# Altium project Cortes.PrjPcb (part 1 of 3)
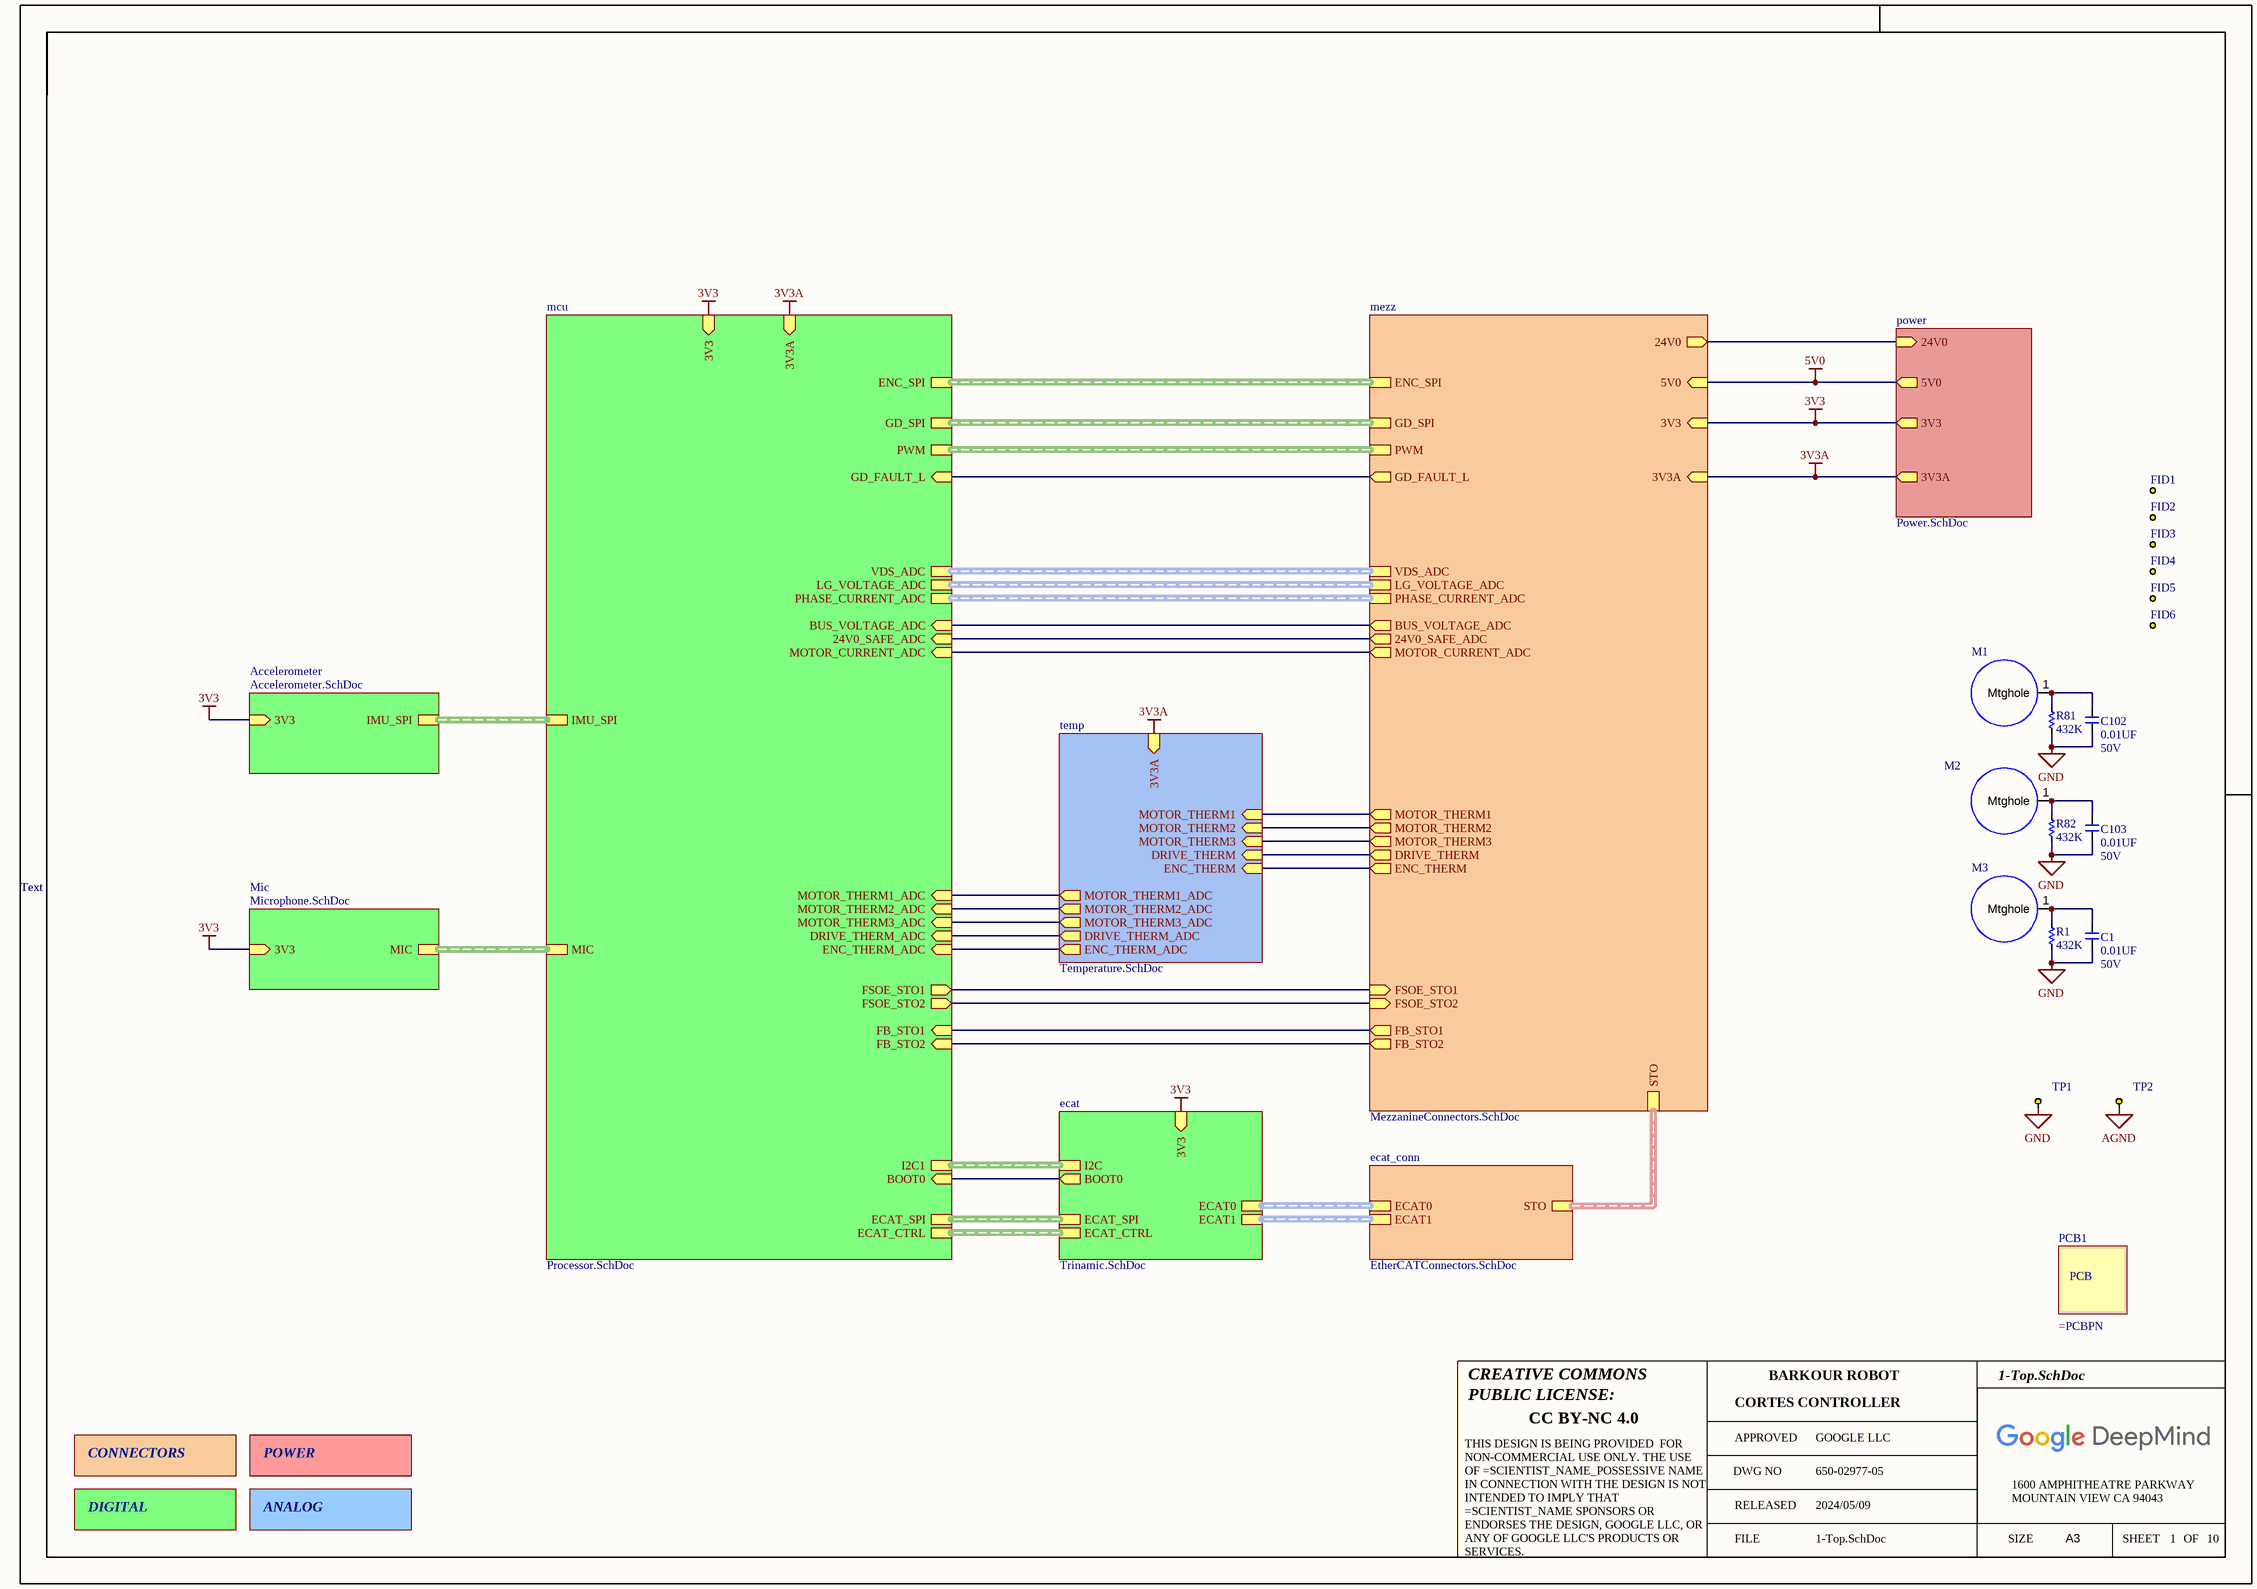
[diagram p0: 1-Top.SchDoc]
GPN_PCB: 651-02977-05; GPN_PCBA: 650-02977-05; PROJECT_NAME: CORTES CONTROLLER; Scientist_Name: CORINNA CORTES; Scientist_Name_Possessive: CORINNA CORTES'S
10 sheets, 268 parts. Net scope: hierarchical (ports join the sheet entries above them; power ports are global).
Board file: Cortes.PcbDoc
Sheets:
  1-Top.SchDoc
    mcu = Processor.SchDoc
      proc_support = ProcessorSupport.SchDoc
    Accelerometer = Accelerometer.SchDoc
    ecat = Trinamic.SchDoc
    power = Power.SchDoc
    temp = Temperature.SchDoc
    Mic = Microphone.SchDoc
    mezz = MezzanineConnectors.SchDoc
    ecat_conn = EtherCATConnectors.SchDoc

## Sheet 1-Top.SchDoc
size 420 x 297 mm; SheetNumber: 1; SheetTotal: 10; PageSetup: Record=PageOptions|CenterHorizontal=True|CenterVertical=True|PrintScale=0.96|XCorrection=1.00|YCorrection=1.00|PrintKind=1|BorderSize=5000000|LeftOffset=0|BottomOffset=0|Orientation=2|PaperLength=4318|PaperWidth=2794|Scale=100|PaperSource=7|PrintQuality=600|MediaType=1|DitherType=10|PaperKind=11" x 17"|PrintScaleMode=1

### Parts
C1  value 0.01UF  Voltage: 50V  [C0402]  (hidden comment: __Template_Cap)
C102  value 0.01UF  Voltage: 50V  [C0402]  (hidden comment: __Template_Cap)
C103  value 0.01UF  Voltage: 50V  [C0402]  (hidden comment: __Template_Cap)
FID1  FIDUCIAL  [FIDUCIAL_1MM]  (value not drawn)  (no BOM)
FID2  FIDUCIAL  [FIDUCIAL_1MM]  (value not drawn)  (no BOM)
FID3  FIDUCIAL  [FIDUCIAL_1MM]  (value not drawn)  (no BOM)
FID4  FIDUCIAL  [FIDUCIAL_1MM]  (value not drawn)  (no BOM)
FID5  FIDUCIAL  [FIDUCIAL_1MM]  (value not drawn)  (no BOM)
FID6  FIDUCIAL  [FIDUCIAL_1MM]  (value not drawn)  (no BOM)
M1  3.7mm hole 5mm pad  [3.7hole5pad]  (value not drawn)
M2  3.7mm hole 5mm pad  [3.7hole5pad]  (value not drawn)
M3  3.7mm hole 5mm pad  [3.7hole5pad]  (value not drawn)
PCB1  PCB  (value not drawn)  (mechanical)
R1  value 432K  [R0805]
R81  value 432K  [R0805]
R82  value 432K  [R0805]
TP1  TEST_KEYSTONE5001  [TP_KEYSTONE_5001]  (value not drawn)
TP2  TEST_KEYSTONE5001  [TP_KEYSTONE_5001]  (value not drawn)

### Sub-sheets
Accelerometer = Accelerometer.SchDoc: IMU_SPI (harness SPI_AGM), 3V3 (in)
ecat = Trinamic.SchDoc: ECAT_SPI (harness SPI), ECAT_CTRL (harness Ethercat_Control), 3V3 (in), ECAT0 (harness ECAT), ECAT1 (harness ECAT), I2C (harness I2C), BOOT0 (out)
ecat_conn = EtherCATConnectors.SchDoc: ECAT0 (harness ECAT), STO (harness STO), ECAT1 (harness ECAT)
mcu = Processor.SchDoc: ENC_SPI (harness SPI), IMU_SPI (harness SPI_AGM), MIC (harness PDM), 3V3 (in), 3V3A (in), PWM (harness PWM), GD_SPI (harness SPI), GD_FAULT_L (in), VDS_ADC (harness Phases), LG_VOLTAGE_ADC (harness Phases), PHASE_CURRENT_ADC (harness Phases), MOTOR_CURRENT_ADC (in), 24V0_SAFE_ADC (in), BUS_VOLTAGE_ADC (in), MOTOR_THERM1_ADC (in), MOTOR_THERM2_ADC (in), MOTOR_THERM3_ADC (in), DRIVE_THERM_ADC (in), ECAT_SPI (harness SPI), ECAT_CTRL (harness Ethercat_Control), ENC_THERM_ADC (in), FSOE_STO2 (out), FB_STO1 (in), FB_STO2 (in), FSOE_STO1 (out), I2C1 (harness I2C), BOOT0 (in)
mezz = MezzanineConnectors.SchDoc: 24V0 (out), 3V3A (in), MOTOR_THERM1 (out), MOTOR_THERM2 (out), MOTOR_THERM3 (out), VDS_ADC (harness Phases), LG_VOLTAGE_ADC (harness Phases), MOTOR_CURRENT_ADC (out), 24V0_SAFE_ADC (out), PHASE_CURRENT_ADC (harness Phases), BUS_VOLTAGE_ADC (out), DRIVE_THERM (out), PWM (harness PWM), GD_SPI (harness SPI), FSOE_STO2 (in), FB_STO1 (out), FB_STO2 (out), FSOE_STO1 (in), GD_FAULT_L (out), 3V3 (in), STO (harness STO), ENC_SPI (harness SPI), ENC_THERM (out), 5V0 (in)
Mic = Microphone.SchDoc: MIC (harness PDM), 3V3 (in)
power = Power.SchDoc: 24V0 (in), 5V0 (out), 3V3 (out), 3V3A (out)
temp = Temperature.SchDoc: 3V3A (in), MOTOR_THERM1 (in), MOTOR_THERM2 (in), MOTOR_THERM3 (in), DRIVE_THERM (in), MOTOR_THERM1_ADC (out), MOTOR_THERM2_ADC (out), MOTOR_THERM3_ADC (out), DRIVE_THERM_ADC (out), ENC_THERM (in), ENC_THERM_ADC (out)

### Nets
3V3: sheet mcu/3V3, sheet Accelerometer/3V3, sheet ecat/3V3, sheet power/3V3, sheet Mic/3V3, sheet mezz/3V3
3V3A: sheet mcu/3V3A, sheet power/3V3A, sheet temp/3V3A, sheet mezz/3V3A
5V0: sheet power/5V0, sheet mezz/5V0
AGND: TP2.1
GND: C1.2 C102.2 C103.2 R1.1 R81.1 R82.1 TP1.1
24V0: sheet power/24V0, sheet mezz/24V0
24V0_SAFE_ADC: sheet mcu/24V0_SAFE_ADC, sheet mezz/24V0_SAFE_ADC
BOOT0: sheet mcu/BOOT0, sheet ecat/BOOT0
BUS_VOLTAGE_ADC: sheet mcu/BUS_VOLTAGE_ADC, sheet mezz/BUS_VOLTAGE_ADC
DRIVE_THERM: sheet temp/DRIVE_THERM, sheet mezz/DRIVE_THERM
DRIVE_THERM_ADC: sheet mcu/DRIVE_THERM_ADC, sheet temp/DRIVE_THERM_ADC
ENC_THERM_ADC: sheet mcu/ENC_THERM_ADC, sheet temp/ENC_THERM_ADC
FB_STO1: sheet mcu/FB_STO1, sheet mezz/FB_STO1
FB_STO2: sheet mcu/FB_STO2, sheet mezz/FB_STO2
FSOE_STO1: sheet mcu/FSOE_STO1, sheet mezz/FSOE_STO1
FSOE_STO2: sheet mcu/FSOE_STO2, sheet mezz/FSOE_STO2
GD_FAULT_L: sheet mcu/GD_FAULT_L, sheet mezz/GD_FAULT_L
MOTOR_CURRENT_ADC: sheet mcu/MOTOR_CURRENT_ADC, sheet mezz/MOTOR_CURRENT_ADC
MOTOR_THERM1: sheet temp/MOTOR_THERM1, sheet mezz/MOTOR_THERM1
MOTOR_THERM1_ADC: sheet mcu/MOTOR_THERM1_ADC, sheet temp/MOTOR_THERM1_ADC
MOTOR_THERM2: sheet temp/MOTOR_THERM2, sheet mezz/MOTOR_THERM2
MOTOR_THERM2_ADC: sheet mcu/MOTOR_THERM2_ADC, sheet temp/MOTOR_THERM2_ADC
MOTOR_THERM3: sheet temp/MOTOR_THERM3, sheet mezz/MOTOR_THERM3
MOTOR_THERM3_ADC: sheet mcu/MOTOR_THERM3_ADC, sheet temp/MOTOR_THERM3_ADC
NetC1_1: C1.1 M3.1(Mtghole) R1.2
NetC18_1: sheet temp/ENC_THERM, sheet mezz/ENC_THERM
NetC102_1: C102.1 M1.1(Mtghole) R81.2
NetC103_1: C103.1 M2.1(Mtghole) R82.2

### Buses and harness runs
harness sheet Accelerometer/IMU_SPI = sheet mcu/IMU_SPI
harness sheet ecat/ECAT0 = sheet ecat_conn/ECAT0
harness sheet ecat/ECAT1 = sheet ecat_conn/ECAT1
harness sheet ecat/ECAT_CTRL = sheet mcu/ECAT_CTRL
harness sheet ecat/ECAT_SPI = sheet mcu/ECAT_SPI
harness sheet ecat/I2C = sheet mcu/I2C1
harness sheet ecat_conn/STO = sheet mezz/STO
harness sheet mcu/ENC_SPI = sheet mezz/ENC_SPI
harness sheet mcu/GD_SPI = sheet mezz/GD_SPI
harness sheet mcu/LG_VOLTAGE_ADC = sheet mezz/LG_VOLTAGE_ADC
harness sheet mcu/MIC = sheet Mic/MIC
harness sheet mcu/PHASE_CURRENT_ADC = sheet mezz/PHASE_CURRENT_ADC
harness sheet mcu/PWM = sheet mezz/PWM
harness sheet mcu/VDS_ADC = sheet mezz/VDS_ADC

### Notes on the sheet
- Text
- CONNECTORS
- POWER
- DIGITAL
- ANALOG
- CREATIVE COMMONS
- PUBLIC LICENSE:
- BARKOUR ROBOT
- CC BY-NC 4.0
- APPROVED
- DWG NO
- GOOGLE LLC
- FILE
- RELEASED
- 2024/05/09
- SIZE
- 1600 AMPHITHEATRE PARKWAY
- MOUNTAIN VIEW CA 94043
- A3
- SHEET
- OF
- THIS DESIGN IS BEING PROVIDED  FOR NON-COMMERCIAL USE ONLY. THE USE OF =SCIENTIST_NAME_POSSESSIVE NAME IN CONNECTION WITH THE DESIGN IS NOT INTENDED TO IMPLY THAT =SCIENTIST_NAME SPONSORS OR ENDORSES THE DESIGN, GOOGLE LLC, OR ANY OF GOOGLE LLC'S PRODUCTS OR SERVICES.

### Library data of the parts
C1 C102 C103 = 625: CAP, CER, X7R, 0.01uF, 50V, 20%, 0402, 0.56mm T; ID: 625; MFG: KEMET; MFG P/N: C0402C103M5RACTU; XPN: 150-00227-00; EES: 150-04592-00; Status: Released; Package: 0402; Dielectric: X7R; Tolerance: 20%; Height: 0.56mm T; ComponentLink1Description: Datasheet; COMMON: 150-00227-00; LOON: 150-00227-00; Gecko: 150-00227-00
FID1-FID6 = 93: FIDUCIAL 1MM COPPER CIRCLE 3MM MASK PULLBACK; ID: 93; MFG: _PCB Feature; Status: In Development
M1-M3 = MtgHole
PCB1 = 110: ID: 110; Level: 1; FindNumber: 010; Org: ORG - REP; Type: PCB; GPN: =PCBPN; Status: In Development; MFG P/N: =PCBPN; PROXY: =PCBPN; Type: 651-PCB; ItemNumber: =PCBPN; ProductLine: Proxy
R1 R81 R82 = 5492: Resistor, 432K Ohms, 0805, 0.125W, ±1%; ID: 5492; MFG: YAGEO; MFG P/N: RC0805FR-07432KL; Power: 1/8W; COMMON: 470-08723-00; XPN: XS-10019230; EES: 470-17987-00; Status: Released; Package: 0805; Tolerance: 1%; Height: 0.60mm; Supplier 1: Digi-Key; LOON: 470-08723-00; Gecko: 470-08723-00; Supplier Part Number 1: 311-432KCRCT-ND
TP1 TP2 = TEST_KEYSTONE5001: PC TEST POINT TH RING; Manufacturer: Keystone Electronics; Manufacturer Part Number: 5001; Part Number: 250-00184-00; Supplier 1: Digi-Key; Supplier Part Number 1: 5001K-ND; RoHS: RoHS Compliant; Category: Test and Measurement; Stock 1: 341830; Pricing 1: 1=0.33, 10=0.309, 50=0.2252, 100=0.2164, 250=0.19432, 500=0.18548, 1000=0.15456, 2500=0.14131, 5000=0.13248 (USD); Packaging: Bulk; Type: PC Test Point, Miniature; Terminal: 0.010" x 0.020" (0.25mm x 0.51mm) Phosphor Bronze Wire, Silver Plate; Mounting Type: 0.040" (1.02mm) Hole Diameter; Material: Base, Nylon 46, UL 94V-0; Color: Black; ComponentLink1URL: http://www.keyelco.com/product-pdf.cfm?p=1310; ComponentLink1Description: http://www.keyelco.com/product-pdf.cfm?p=1310

## Sheet Processor.SchDoc
size 420 x 297 mm; SheetNumber: 6; SheetTotal: 10; PageSetup: Record=PageOptions|CenterHorizontal=True|CenterVertical=True|PrintScale=0.96|XCorrection=1.00|YCorrection=1.00|PrintKind=1|BorderSize=5000000|LeftOffset=0|BottomOffset=0|Orientation=2|PaperLength=4318|PaperWidth=2794|Scale=100|PaperSource=7|PrintQuality=600|MediaType=1|DitherType=10|PaperKind=11" x 17"|PrintScaleMode=1
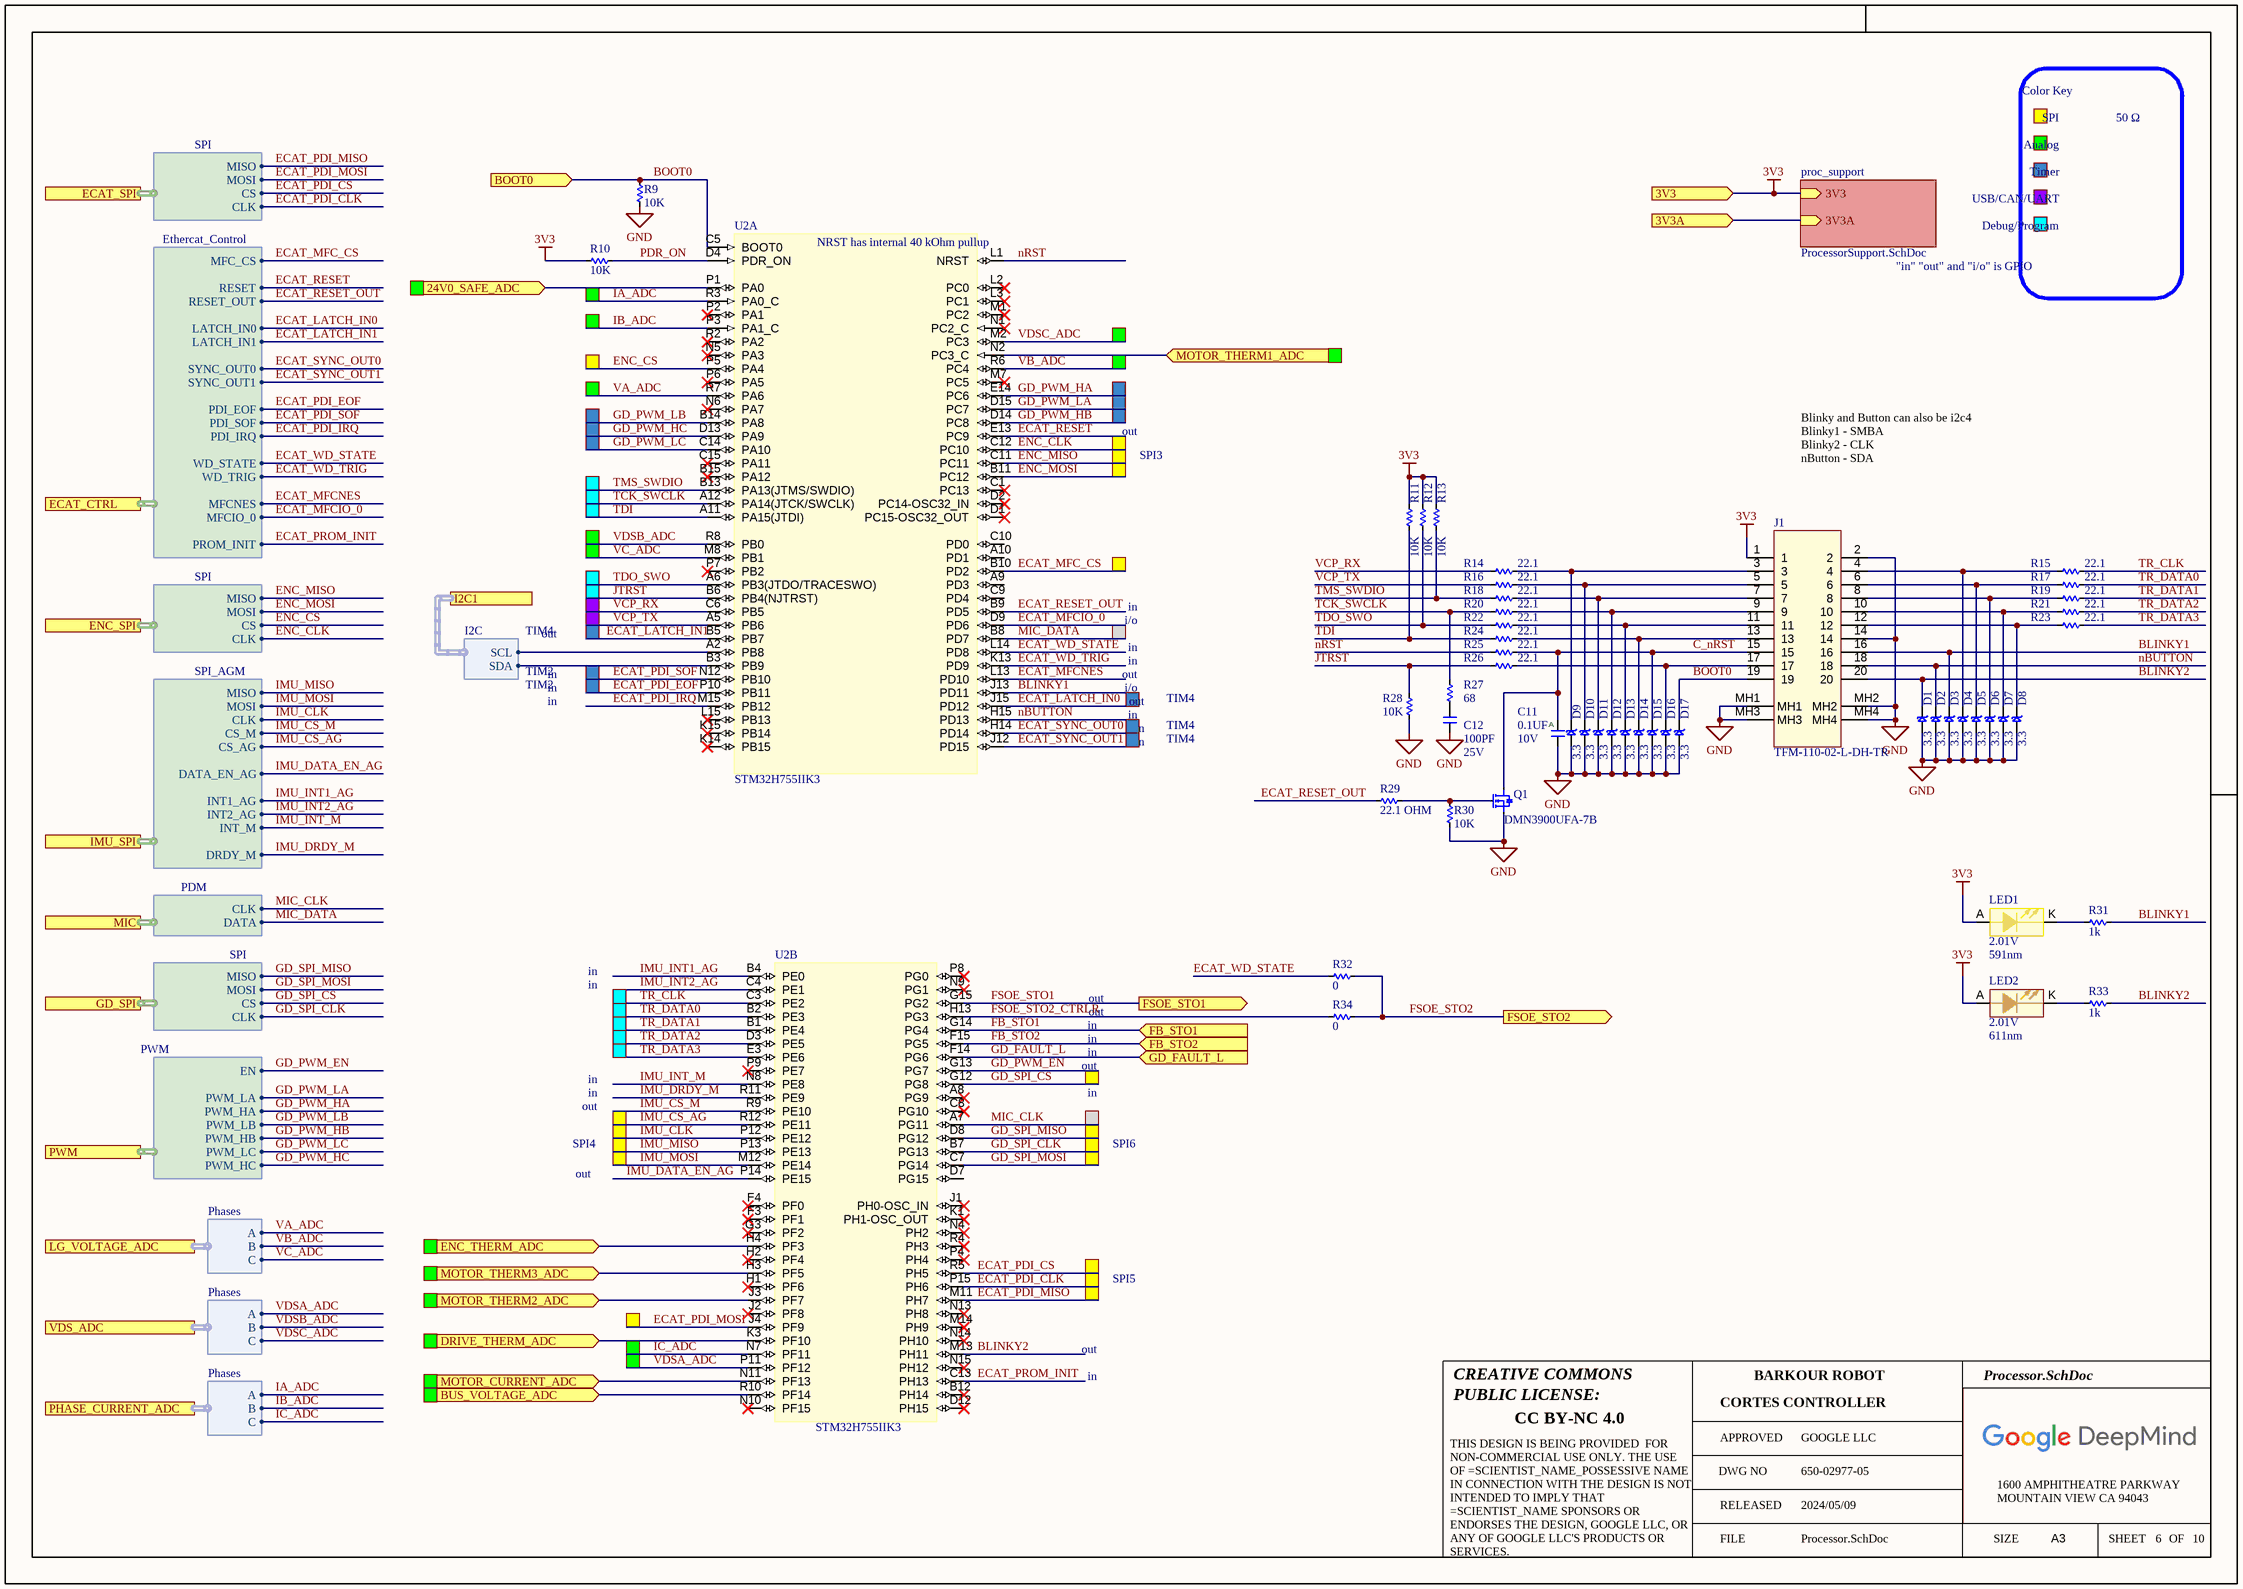
[diagram p1: Processor.SchDoc]

### Parts
C11  value 0.1UF  Voltage: 10V  [C0201Y]  (hidden comment: __Template_Cap_Auto)
C12  value 100PF  Voltage: 25V  [C0201Y]  (hidden comment: __Template_Cap)
D1  3.3  [SOD1060X40]
D2  3.3  [SOD1060X40]
D3  3.3  [SOD1060X40]
D4  3.3  [SOD1060X40]
D5  3.3  [SOD1060X40]
D6  3.3  [SOD1060X40]
D7  3.3  [SOD1060X40]
D8  3.3  [SOD1060X40]
D9  3.3  [SOD1060X40]
D10  3.3  [SOD1060X40]
D11  3.3  [SOD1060X40]
D12  3.3  [SOD1060X40]
D13  3.3  [SOD1060X40]
D14  3.3  [SOD1060X40]
D15  3.3  [SOD1060X40]
D16  3.3  [SOD1060X40]
D17  3.3  [SOD1060X40]
J1  MFG P/N: TFM-110-02-L-DH-TR  [SAMTEC_TFM-110-02-L-DH]
LED1  Voltage – Forward (VF) (MAX) @ IF: 2.01V  Color / Wavelength: 591nm  [LED_APG0603SYC-TT]  (hidden comment: __Template_LED_YELLOW_AK)
LED2  Voltage – Forward (VF) (MAX) @ IF: 2.01V  Color / Wavelength: 611nm  [LED_APG0603SYC-TT]  (hidden comment: __Template_LED_ORANGE_AK)
Q1  MFG P/N: DMN3900UFA-7B  [3XDFN]  (hidden comment: NFET_DMN3900UFA)
R9  value 10K  [R0201_H0.26MM]  (hidden comment: __Template_Resistor)
R10  value 10K  [R0201_H0.26MM]  (hidden comment: __Template_Resistor)
R11  value 10K  [R0201_H0.26MM]  (hidden comment: __Template_Resistor)
R12  value 10K  [R0201_H0.26MM]  (hidden comment: __Template_Resistor)
R13  value 10K  [R0201_H0.26MM]  (hidden comment: __Template_Resistor)
R14  value 22.1  [R0201_H0.26MM]  (hidden comment: __Template_Resistor)
R15  value 22.1  [R0201_H0.26MM]  (hidden comment: __Template_Resistor)
R16  value 22.1  [R0201_H0.26MM]  (hidden comment: __Template_Resistor)
R17  value 22.1  [R0201_H0.26MM]  (hidden comment: __Template_Resistor)
R18  value 22.1  [R0201_H0.26MM]  (hidden comment: __Template_Resistor)
R19  value 22.1  [R0201_H0.26MM]  (hidden comment: __Template_Resistor)
R20  value 22.1  [R0201_H0.26MM]  (hidden comment: __Template_Resistor)
R21  value 22.1  [R0201_H0.26MM]  (hidden comment: __Template_Resistor)
R22  value 22.1  [R0201_H0.26MM]  (hidden comment: __Template_Resistor)
R23  value 22.1  [R0201_H0.26MM]  (hidden comment: __Template_Resistor)
R24  value 22.1  [R0201_H0.26MM]  (hidden comment: __Template_Resistor)
R25  value 22.1  [R0201_H0.26MM]  (hidden comment: __Template_Resistor)
R26  value 22.1  [R0201_H0.26MM]  (hidden comment: __Template_Resistor)
R27  value 68  [R0201_H0.26MM]  (hidden comment: __Template_Resistor)
R28  value 10K  [R0201_H0.26MM]  (hidden comment: __Template_Resistor)
R29  value 22.1 OHM  [R0201_H0.26MM]  (hidden comment: __Template_Resistor)
R30  value 10K  [R0201_H0.26MM]  (hidden comment: __Template_Resistor)
R31  value 1k  [R0201_H0.26MM]  (hidden comment: __Template_Resistor)
R32  value 0  [R0603]  (hidden comment: __Template_Resistor)
R33  value 1k  [R0201_H0.26MM]  (hidden comment: __Template_Resistor)
R34  value 0  [R0603]  (hidden comment: __Template_Resistor)
U2  MFG P/N: STM32H755IIK3  [BGS201C65P15X15_1000X1000X60]  (hidden comment: MCU_STM32H755IIK3)  (parts A,B of 3)

### Sub-sheets
proc_support = ProcessorSupport.SchDoc: 3V3 (in), 3V3A (in)

### Ports
3V3 (in), 3V3A (in), 24V0_SAFE_ADC (in), BOOT0 (in), BUS_VOLTAGE_ADC (in), DRIVE_THERM_ADC (in), ECAT_CTRL (harness Ethercat_Control), ECAT_SPI (harness SPI), ENC_SPI (harness SPI), ENC_THERM_ADC (in), FB_STO1 (in), FB_STO2 (in), FSOE_STO1 (out), FSOE_STO2 (out), GD_FAULT_L (in), GD_SPI (harness SPI), I2C1 (harness I2C), IMU_SPI (harness SPI_AGM), LG_VOLTAGE_ADC (harness Phases), MIC (harness PDM), MOTOR_CURRENT_ADC (in), MOTOR_THERM1_ADC (in), MOTOR_THERM2_ADC (in), MOTOR_THERM3_ADC (in), PHASE_CURRENT_ADC (harness Phases), PWM (harness PWM), VDS_ADC (harness Phases)

### Harnesses
SPI: CLK, CS, MOSI, MISO
PDM: DATA, CLK
SPI: MISO, MOSI, CS, CLK
Ethercat_Control: MFC_CS, LATCH_IN0, LATCH_IN1, RESET_OUT, SYNC_OUT0, SYNC_OUT1, PDI_EOF, PDI_SOF, PDI_IRQ, RESET, WD_STATE, WD_TRIG, MFCNES, MFCIO_0, PROM_INIT
SPI_AGM: CLK, MOSI, CS_AG, DATA_EN_AG, CS_M, MISO, INT1_AG, INT2_AG, INT_M, DRDY_M
PWM: EN, PWM_LA, PWM_HA, PWM_LB, PWM_HB, PWM_LC, PWM_HC
Phases: A, B, C
I2C: SDA, SCL

### Nets
3V3: J1.1 LED1.A LED2.A R10.2 R11.2 R12.2 R13.2 ; port 3V3, sheet proc_support/3V3
3V3A: port 3V3A, sheet proc_support/3V3A
GND: C11.2 C12.2 D1.A D2.A D3.A D4.A D5.A D6.A D7.A D8.A D9.A D10.A D11.A D12.A D13.A D14.A D15.A D16.A D17.A J1.2 J1.14 J1.MH1 J1.MH2 J1.MH3 J1.MH4 Q1.2(S) R9.1 R28.1 R30.1
24V0_SAFE_ADC: U2.P1(PA0) ; port 24V0_SAFE_ADC
BLINKY1: D3.K J1.16 R31.1 U2.J13(PD11)
BLINKY2: D1.K J1.20 R33.1 U2.M13(PH11)
BOOT0: D17.K J1.19 R9.2 U2.C5(BOOT0) ; port BOOT0
BUS_VOLTAGE_ADC: U2.R10(PF14) ; port BUS_VOLTAGE_ADC
C_nRST: C11.1 D15.K J1.15 Q1.3(D) R25.2
DRIVE_THERM_ADC: U2.K3(PF10) ; port DRIVE_THERM_ADC
ECAT_LATCH_IN0: U2.J15(PD12) ; port ECAT_CTRL.LATCH_IN0
ECAT_LATCH_IN1: U2.B5(PB7) ; port ECAT_CTRL.LATCH_IN1
ECAT_MFC_CS: U2.B10(PD2) ; port ECAT_CTRL.MFC_CS
ECAT_MFCIO_0: U2.D9(PD6) ; port ECAT_CTRL.MFCIO_0
ECAT_MFCNES: U2.L13(PD10) ; port ECAT_CTRL.MFCNES
ECAT_PDI_CLK: U2.P15(PH6) ; port ECAT_SPI.CLK
ECAT_PDI_CS: U2.R5(PH5) ; port ECAT_SPI.CS
ECAT_PDI_EOF: U2.P10(PB11) ; port ECAT_CTRL.PDI_EOF
ECAT_PDI_IRQ: U2.M15(PB12) ; port ECAT_CTRL.PDI_IRQ
ECAT_PDI_MISO: U2.M11(PH7) ; port ECAT_SPI.MISO
ECAT_PDI_MOSI: U2.J4(PF9) ; port ECAT_SPI.MOSI
ECAT_PDI_SOF: U2.N12(PB10) ; port ECAT_CTRL.PDI_SOF
ECAT_PROM_INIT: U2.C13(PH13) ; port ECAT_CTRL.PROM_INIT
ECAT_RESET: U2.E13(PC9) ; port ECAT_CTRL.RESET
ECAT_RESET_OUT: R29.1 U2.B9(PD5) ; port ECAT_CTRL.RESET_OUT
ECAT_SYNC_OUT0: U2.H14(PD14) ; port ECAT_CTRL.SYNC_OUT0
ECAT_SYNC_OUT1: U2.J12(PD15) ; port ECAT_CTRL.SYNC_OUT1
ECAT_WD_STATE: R32.2 U2.L14(PD8) ; port ECAT_CTRL.WD_STATE
ECAT_WD_TRIG: U2.K13(PD9) ; port ECAT_CTRL.WD_TRIG
ENC_CLK: U2.C12(PC10) ; port ENC_SPI.CLK
ENC_CS: U2.P5(PA4) ; port ENC_SPI.CS
ENC_MISO: U2.C11(PC11) ; port ENC_SPI.MISO
ENC_MOSI: U2.B11(PC12) ; port ENC_SPI.MOSI
ENC_THERM_ADC: U2.H4(PF3) ; port ENC_THERM_ADC
FB_STO1: U2.G14(PG4) ; port FB_STO1
FB_STO2: U2.F15(PG5) ; port FB_STO2
FSOE_STO1: U2.G15(PG2) ; port FSOE_STO1
FSOE_STO2: R32.1 R34.1 ; port FSOE_STO2
FSOE_STO2_CTRLR: R34.2 U2.H13(PG3)
GD_FAULT_L: U2.F14(PG6) ; port GD_FAULT_L
GD_PWM_EN: U2.G13(PG7) ; port PWM.EN
GD_PWM_HA: U2.E14(PC6) ; port PWM.PWM_HA
GD_PWM_HB: U2.D14(PC8) ; port PWM.PWM_HB
GD_PWM_HC: U2.D13(PA9) ; port PWM.PWM_HC
GD_PWM_LA: U2.D15(PC7) ; port PWM.PWM_LA
GD_PWM_LB: U2.B14(PA8) ; port PWM.PWM_LB
GD_PWM_LC: U2.C14(PA10) ; port PWM.PWM_LC
GD_SPI_CLK: U2.B7(PG13) ; port GD_SPI.CLK
GD_SPI_CS: U2.G12(PG8) ; port GD_SPI.CS
GD_SPI_MISO: U2.D8(PG12) ; port GD_SPI.MISO
GD_SPI_MOSI: U2.C7(PG14) ; port GD_SPI.MOSI
IA_ADC: U2.R3(PA0_C) ; port PHASE_CURRENT_ADC.A
IB_ADC: U2.P3(PA1_C) ; port PHASE_CURRENT_ADC.B
IC_ADC: U2.N7(PF11) ; port PHASE_CURRENT_ADC.C
IMU_CLK: U2.P12(PE12) ; port IMU_SPI.CLK  [project net AGM_CLK]
IMU_CS_AG: U2.R12(PE11) ; port IMU_SPI.CS_AG  [project net AGM_CS_AG]
IMU_CS_M: U2.R9(PE10) ; port IMU_SPI.CS_M  [project net AGM_CS_M]
IMU_DATA_EN_AG: U2.P14(PE15) ; port IMU_SPI.DATA_EN_AG  [project net AGM_DATA_EN_AG]
IMU_DRDY_M: U2.R11(PE9) ; port IMU_SPI.DRDY_M  [project net AGM_DRDY_M]
IMU_INT1_AG: U2.B4(PE0) ; port IMU_SPI.INT1_AG  [project net AGM_INT1_AG]
IMU_INT2_AG: U2.C4(PE1) ; port IMU_SPI.INT2_AG  [project net AGM_INT2_AG]
IMU_INT_M: U2.N8(PE8) ; port IMU_SPI.INT_M  [project net AGM_INT_M]
IMU_MISO: U2.P13(PE13) ; port IMU_SPI.MISO  [project net AGM_MISO]
IMU_MOSI: U2.M12(PE14) ; port IMU_SPI.MOSI  [project net AGM_MOSI]
JTRST: R26.1 R28.2 U2.B6(PB4(NJTRST))
MFCIO_SCL: U2.A2(PB8) ; port I2C1.SCL
MFCIO_SDA: U2.B3(PB9) ; port I2C1.SDA
MIC_CLK: U2.A7(PG11) ; port MIC.CLK
MIC_DATA: U2.B8(PD7) ; port MIC.DATA
MOTOR_CURRENT_ADC: U2.N11(PF13) ; port MOTOR_CURRENT_ADC
MOTOR_THERM1_ADC: U2.N2(PC3_C) ; port MOTOR_THERM1_ADC
MOTOR_THERM2_ADC: U2.J3(PF7) ; port MOTOR_THERM2_ADC
MOTOR_THERM3_ADC: U2.H3(PF5) ; port MOTOR_THERM3_ADC
nBUTTON: D2.K J1.18 U2.H15(PD13)
nRST: R25.1 U2.L1(NRST)
PDR_ON: R10.1 U2.D4(PDR_ON)
TCK_SWCLK: R20.1 R27.2 U2.A12(PA14(JTCK/SWCLK))
TDI: R11.1 R24.1 U2.A11(PA15(JTDI))
TDO_SWO: R12.1 R22.1 U2.A6(PB3(JTDO/TRACESWO))
TMS_SWDIO: R13.1 R18.1 U2.B13(PA13(JTMS/SWDIO))
TR_CLK: R15.2 U2.C3(PE2)
TR_DATA0: R17.2 U2.B2(PE3)
TR_DATA1: R19.2 U2.B1(PE4)
TR_DATA2: R21.2 U2.D3(PE5)
TR_DATA3: R23.2 U2.E3(PE6)
VA_ADC: U2.R7(PA6) ; port LG_VOLTAGE_ADC.A
VB_ADC: U2.R6(PC4) ; port LG_VOLTAGE_ADC.B
VC_ADC: U2.M8(PB1) ; port LG_VOLTAGE_ADC.C
VCP_RX: R14.1 U2.C6(PB5)
VCP_TX: R16.1 U2.A5(PB6)
VDSA_ADC: U2.P11(PF12) ; port VDS_ADC.A
VDSB_ADC: U2.R8(PB0) ; port VDS_ADC.B
VDSC_ADC: U2.M2(PC3) ; port VDS_ADC.C
NetC12_1: C12.1 R27.1
NetD4_K: D4.K J1.4 R15.1
NetD5_K: D5.K J1.6 R17.1
NetD6_K: D6.K J1.8 R19.1
NetD7_K: D7.K J1.10 R21.1
NetD8_K: D8.K J1.12 R23.1
NetD9_K: D9.K J1.3 R14.2
NetD10_K: D10.K J1.5 R16.2
NetD11_K: D11.K J1.7 R18.2
NetD12_K: D12.K J1.9 R20.2
NetD13_K: D13.K J1.11 R22.2
NetD14_K: D14.K J1.13 R24.2
NetD16_K: D16.K J1.17 R26.2
NetLED1_K: LED1.K R31.2
NetLED2_K: LED2.K R33.2
NetQ1_1: Q1.1(G) R29.2 R30.2

Not connected (* = marked no-connect by the designer): U2 A8(PG9)* A9(PD3) A10(PD1) B12(PH14)* B15(PA12)* C1(PC13)* C8(PG10)* C9(PD4) C10(PD0) C15(PA11)* D1(PC15-OSC32_OUT)* D2(PC14-OSC32_IN)* D7(PG15) D12(PH15)* F3(PF1)* F4(PF0)* G3(PF2)* H1(PF6)* H2(PF4)* J1(PH0-OSC_IN)* J2(PF8)* K1(PH1-OSC_OUT)* K14(PB15)* K15(PB14)* L2(PC0)* L3(PC1)* L15(PB13)* M1(PC2)* M7(PC5)* M14(PH9)* N1(PC2_C)* N4(PH2)* N5(PA3)* N6(PA7)* N9(PG1)* N10(PF15)* N13(PH8)* N14(PH10)* N15(PH12)* P2(PA1)* P4(PH4)* P6(PA5)* P7(PB2)* P8(PG0)* P9(PE7)* R2(PA2)* R4(PH3)*

### Notes on the sheet
- SPI
- Color Key
- 50 Ω
- Analog
- Timer
- USB/CAN/UART
- (near U2) NRST has internal 40 kOhm pullup
- "in" "out" and "i/o" is GPIO
- Debug/Program
- out
- SPI3
- Blinky and Button can also be i2c4
  Blinky1 - SMBA
  Blinky2 - CLK
  nButton - SDA
- in
- TIM4
- i/o
- TIM2
- SPI4
- SPI6
- SPI5
- CREATIVE COMMONS
- PUBLIC LICENSE:
- BARKOUR ROBOT
- CC BY-NC 4.0
- APPROVED
- DWG NO
- GOOGLE LLC
- FILE
- RELEASED
- 2024/05/09
- SIZE
- 1600 AMPHITHEATRE PARKWAY
- MOUNTAIN VIEW CA 94043
- A3
- SHEET
- OF
- THIS DESIGN IS BEING PROVIDED  FOR NON-COMMERCIAL USE ONLY. THE USE OF =SCIENTIST_NAME_POSSESSIVE NAME IN CONNECTION WITH THE DESIGN IS NOT INTENDED TO IMPLY THAT =SCIENTIST_NAME SPONSORS OR ENDORSES THE DESIGN, GOOGLE LLC, OR ANY OF GOOGLE LLC'S PRODUCTS OR SERVICES.
- (in symbol 934) A

### Library data of the parts
C11 = 934: CAP, CER, X6S, 0.1uF, 10V, 10%, 0201, AUTOGRADE; ID: 934; MFG: MURATA; MFG P/N: GRT033C81A104KE01D; XPN: 150-01178-00; Gecko: 150-04546-00; EES: 150-04563-00; Status: Released; Package: 0201; Dielectric: X6S; Tolerance: 10%; Height: 0.33mm T; Supplier 1: Digi-key; HelpURL: https://www.digikey.com/product-detail/en/murata-electronics/GRT033C81A104KE01D/490-12232-1-ND/5416933; ComponentLink1Description: Datasheet; ComponentLink1URL: https://search.murata.co.jp/Ceramy/image/img/A01X/G101/ENG/GRT033C81A104KE01-01.pdf; COMMON: 150-01178-00; LOON: 150-01178-00; Supplier Part Number 1: 490-12232-1-ND
C12 = 767: CAP, CER, X7R, 100pF, 25V, 10%, 0201, 0.33mm T; ID: 767; MFG: MURATA; MFG P/N: GRM033R71E101KA01D; XPN: 150-00022-00; EES: 150-04573-00; Status: Released; Package: 0201; Dielectric: X7R; Tolerance: 10%; Height: 0.33mm T; ComponentLink1Description: Datasheet; COMMON: 150-00022-00; LOON: 150-00022-00; Gecko: 150-00022-00
D1-D17 = 192: TVS, DIODE, UNIDIR, 3.3VRWM, 4.8VBR, 7.8VCL, SOD-923; ID: 192; MFG: ON Semiconductor; MFG P/N: ESD9R3.3ST5G; Value: ESD9R3.3ST5G; Diode Type: Zener; PROXY: 480-01364-00; LOON: 430-00045-00; Voltage - Clamping (Max) @ Ipp: 7.8V; Status: Released; Package: SOD-923; Category: Diode; RoHS Compliant: Yes; Mounting Type: SMD; Operating Temperature – Junction: -55°C ~ 125°C (TJ); Supplier 1: Digi-Key; HelpURL: https://www.digikey.in/product-detail/en/on-semiconductor/ESD9R3.3ST5G/ESD9R3.3ST5GOSCT-ND/2704997; ComponentLink1Description: Datasheet; ComponentLink1URL: http://www.onsemi.com/pub/Collateral/ESD9R3.3S-D.PDF; Height: 0.4mm; Supplier Part Number 1: ESD9R3.3ST5GOSCT-ND
J1 = 1204: CONN, HDR, SHRD, RA, 2x10, 1.27MM P, 6.02MM h, GOLD, TH; ID: 1204; MFG: Samtec Inc; Connector Type: Header; Number of Positions: 20; Current Rating: 2.9A; Voltage, Rated: 275VAC; Sub Assy Qty 2: 0; EES: 210-04980-00; Status: Released; RoHS Compliant: Yes; Mounting Type: Surface Mount; Orientation: Right Angle; Pitch: 1.27mm; Number of Rows: 2; Row Spacing: 1.27mm; Gender: Header; Operating Temperature: -55°C ~ 125°C; Supplier 1: Digi-Key; HelpURL: https://www.digikey.com/en/products/detail/samtec-inc/TFM-110-02-L-DH-TR/6694026; ComponentLink1Description: Datasheet; ComponentLink1URL: http://suddendocs.samtec.com/prints/tfm-1xx-xx-x-dh-xx-mkt.pdf; Height: 6.02mm; Supplier Part Number 1: SAM14687TR-ND; Sub Assy Qty 3: 0; Sub Assy Qty 4: 0
LED1 = 307: LED, YELLOW, 591NM, 10mA, CLEAR, 0201; ID: 307; MFG: Kingbright; MFG P/N: APG0603SYC-TT; Value: APG0603SYC-TT; EES: 370-00612-00; Status: Released; Package: 0201; Category: LED; RoHS Compliant: Yes; Diode Type: LED; Mounting Type: SMD; Supplier 1: Digi-Key; HelpURL: https://www.digikey.com/product-detail/en/kingbright/APG0603SYC-TT/754-2025-1-ND/6072772; ComponentLink1Description: Datasheet; ComponentLink1URL: http://www.kingbrightusa.com/images/catalog/SPEC/APG0603SYC-TT.pdf; Height: 0.25mm; Supplier Part Number 1: 754-2025-1-ND
LED2 = 308: LED, ORANGE, 611NM, 10mA, CLEAR, 0201; ID: 308; MFG: Kingbright; MFG P/N: APG0603SEC-TT; Value: APG0603SEC-TT; EES: 370-00613-00; Status: Released; Package: 0201; Category: LED; RoHS Compliant: Yes; Diode Type: LED; Mounting Type: SMD; Supplier 1: Digi-Key; HelpURL: https://www.digikey.com/product-detail/en/kingbright/APG0603SEC-TT/754-2027-1-ND/6072774; ComponentLink1Description: Datasheet; ComponentLink1URL: http://www.kingbrightusa.com/images/catalog/SPEC/APG0603SEC-TT.pdf; Height: 0.25mm; Supplier Part Number 1: 754-2027-1-ND
Q1 = 24: MOSFET, N-CH, 30V, 0.55A, DMN3900; ID: 24; MFG: Diodes Incorporated; FET Type: MOSFET N-Channel, Metal Oxide; FET Feature: Logic Level Gate; Current - Continuios Drain (ID) @ 25° C: 550mA; RDS On (Max) @ ID, VGS: 760 mOhm @ 200mA, 4.5V; VGS(TH) (Max) @ ID: 950mV @ 250µA; Gate Charge (QG) @ VGS: 0.7nC @ 4.5V; Input Capacitance (CISS) @ VDS: 42.2pF @ 25V; Power - Max: 390mW; COMMON: 480-00750-00; XPN: XS-10020699; EES: 480-01751-00; Status: Released; Package: 3-XFDFN; Category: Discrete Semiconductor Products; RoHS Compliant: Yes; HelpURL: http://www.diodes.com/datasheets/DMN3900UFA.pdf; ComponentLink1Description: Datasheet; ComponentLink1URL: http://www.diodes.com/datasheets/DMN3900UFA.pdf; Voltage - Drain To Source (VDSS): 30V; Mounting Type: SM; Supplier 1: Digi-Key; LOON: 480-00750-00; Gecko: 480-00750-00; Supplier Part Number 1: DMN3900UFA-7BCT-ND
R9-R13 R28 R30 = 6783: RES, 10K, 1%, 1/20W, 0201, AUTOGRADE; ID: 6783; MFG: PANASONIC; MFG P/N: ERJ1GNF1002C; COMMON: 470-00033-00; PROXY: Use ID #4151; EES: 470-18014-00; Status: Released; Package: 0201; Power: 1/20W; Tolerance: 1%; Height: 0.26mm; Supplier 1: Digi-Key; HelpURL: https://www.digikey.in/product-detail/en/panasonic-electronic-components/ERJ-1GNF1002C/P122414CT-ND/7389440; ComponentLink1Description: Datasheet; ComponentLink1URL: https://industrial.panasonic.com/cdbs/www-data/pdf/RDA0000/AOA0000C304.pdf; LOON: 470-00033-00; Gecko: 470-00033-00; XPN: 470-00033-00; Supplier Part Number 1: P122414CT-ND
R14-R26 R29 = 10012: RES, 22.1, 1%, 1/20W, 0201, AUTOGRADE; ID: 10012; MFG: Panasonic Electronic Components; MFG P/N: ERJ-1GNF22R1C; Catagory: Chip Resistor - Surface Mount; Power: 0.05W, 1/20W; EES: 470-18023-00; Status: Released; Package: 0201; Tolerance: 1%; Height: 0.26mm; Supplier 1: Digi-Key; HelpURL: https://www.digikey.in/product-detail/en/panasonic-electronic-components/ERJ-1GNF22R1C/P122844CT-ND/8342627; ComponentLink1Description: Datasheet; ComponentLink1URL: https://industrial.panasonic.com/cdbs/www-data/pdf/RDA0000/AOA0000C304.pdf; Supplier Part Number 1: P122844CT-ND
R27 = 10014: RES, 68, 1%, 1/20W, 0201, AUTOGRADE; ID: 10014; MFG: Panasonic Electronic Components; MFG P/N: ERJ-1GNF68R0C; Catagory: Chip Resistor - Surface Mount; Power: 0.05W, 1/20W; EES: 470-18010-00; Status: Released; Package: 0201; Tolerance: 1%; Height: 0.26mm; Supplier 1: Digi-Key; HelpURL: https://www.digikey.in/product-detail/en/panasonic-electronic-components/ERJ-1GNF68R0C/P123132CT-ND/8343203; ComponentLink1Description: Datasheet; ComponentLink1URL: https://industrial.panasonic.com/cdbs/www-data/pdf/RDA0000/AOA0000C304.pdf; Supplier Part Number 1: P123132CT-ND
R31 R33 = 10010: RES, 1K, 1%, 1/20W, 0201, AUTOGRADE; ID: 10010; MFG: Bourns Inc.; MFG P/N: CR0201AFW-1001GLF; Power: 0.05W, 1/20W; Catagory: Chip Resistor - Surface Mount; EES: 470-18022-00; Status: Released; Package: 0201; Tolerance: 1%; Height: 0.26mm; Supplier 1: Digi-Key; HelpURL: https://www.digikey.in/product-detail/en/bourns-inc/CR0201AFW-1001GLF/118-CR0201AFW-1001GLFCT-ND/12091423; ComponentLink1Description: Datasheet; ComponentLink1URL: https://www.bourns.com/docs/product-datasheets/crxxxxa.pdf; Supplier Part Number 1: 118-CR0201AFW-1001GLFCT-ND
R32 R34 = 3: RES, JUMPER, 0, 1/10W, 0603; ID: 3; MFG: ROHM; MFG P/N: MCR03EZPJ000; COMMON: 470-03590-00; PROXY: Use ID #8521; XPN: XS-10014546; EES: 470-17795-00; Status: NRND; Package: 0603; Power: 1/10W; Tolerance: JUMPER; Height: 0.55mm; Supplier 1: Digi-Key; Supplier Part Number 1: RHM0.0GCT-ND; LOON: 470-03590-00; Gecko: 470-03590-00
U2 = 112: IC, MCU, STM32H755xI, ARM, 32-BIT, 240MHZ, 128 I/O, 2MB, FLASH, 1.62V TO 3.6V, UFBGA-201; ID: 112; MFG: STMicroelectronics; EES: 313-05804-00; Status: Released; Package: 176+25UFBGA (10x10); Category: Integrated Circuits (ICs); RoHS Compliant: Yes; Supplier 1: Digi-Key; HelpURL: https://www.digikey.com/products/en?keywords=STM32H755IIK3; ComponentLink1Description: Datasheet; ComponentLink1URL: https://www.st.com/resource/en/datasheet/stm32h755ii.pdf; Height: 0.6mm; Supplier Part Number 1: 497-STM32H755IIK3-ND

## Sheet ProcessorSupport.SchDoc
size 420 x 297 mm; SheetNumber: 7; SheetTotal: 10; PageSetup: Record=PageOptions|CenterHorizontal=True|CenterVertical=True|PrintScale=0.96|XCorrection=1.00|YCorrection=1.00|PrintKind=1|BorderSize=5000000|LeftOffset=0|BottomOffset=0|Orientation=2|PaperLength=4318|PaperWidth=2794|Scale=100|PaperSource=7|PrintQuality=600|MediaType=1|DitherType=10|PaperKind=11" x 17"|PrintScaleMode=1
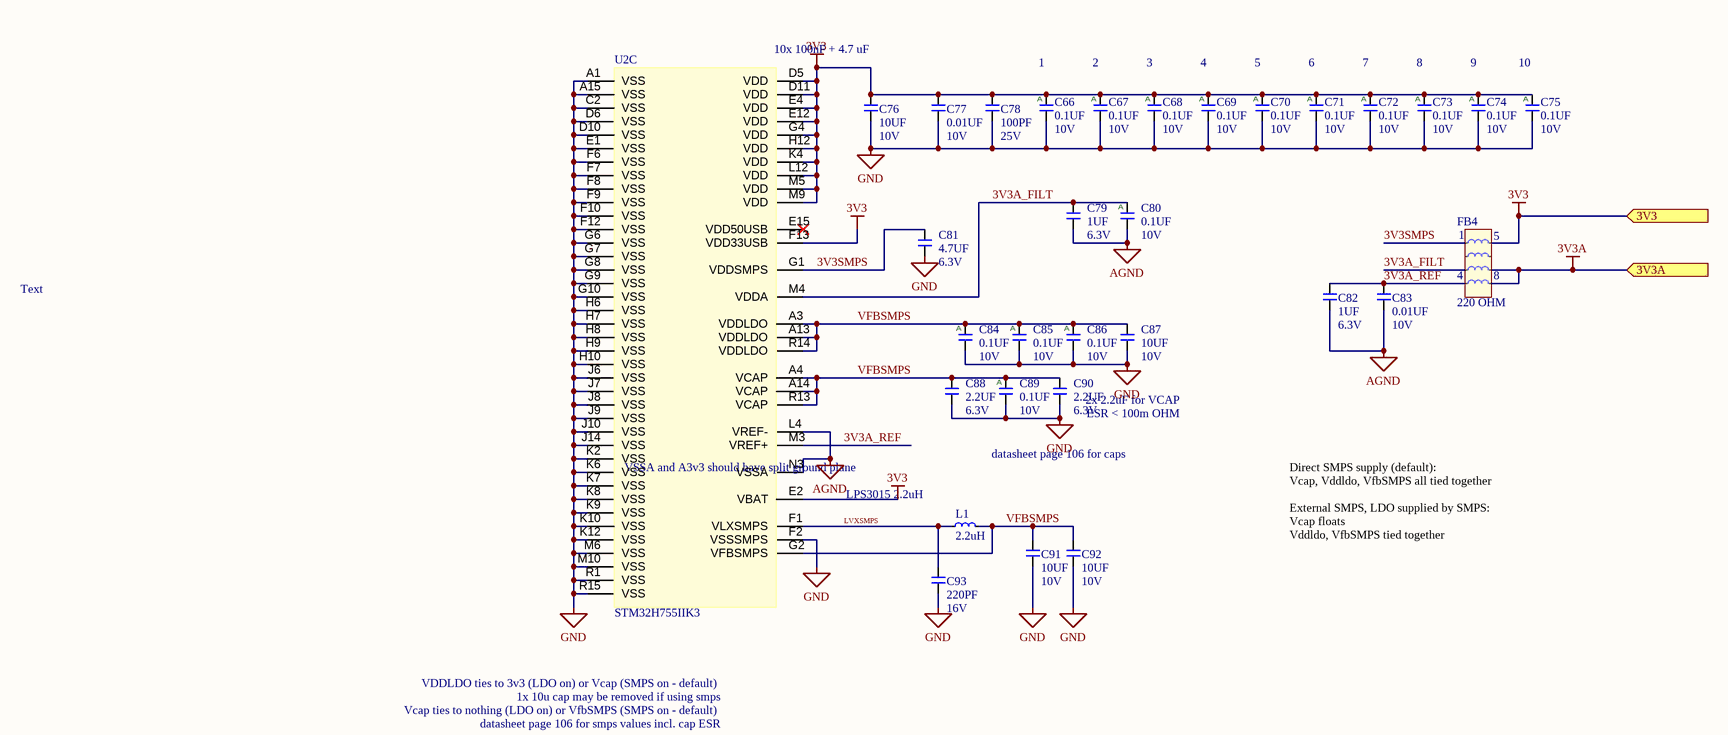
[diagram p2: ProcessorSupport.SchDoc]

### Parts
C66  value 0.1UF  Voltage: 10V  [C0201Y]  (hidden comment: __Template_Cap_Auto)
C67  value 0.1UF  Voltage: 10V  [C0201Y]  (hidden comment: __Template_Cap_Auto)
C68  value 0.1UF  Voltage: 10V  [C0201Y]  (hidden comment: __Template_Cap_Auto)
C69  value 0.1UF  Voltage: 10V  [C0201Y]  (hidden comment: __Template_Cap_Auto)
C70  value 0.1UF  Voltage: 10V  [C0201Y]  (hidden comment: __Template_Cap_Auto)
C71  value 0.1UF  Voltage: 10V  [C0201Y]  (hidden comment: __Template_Cap_Auto)
C72  value 0.1UF  Voltage: 10V  [C0201Y]  (hidden comment: __Template_Cap_Auto)
C73  value 0.1UF  Voltage: 10V  [C0201Y]  (hidden comment: __Template_Cap_Auto)
C74  value 0.1UF  Voltage: 10V  [C0201Y]  (hidden comment: __Template_Cap_Auto)
C75  value 0.1UF  Voltage: 10V  [C0201Y]  (hidden comment: __Template_Cap_Auto)
C76  value 10UF  Voltage: 10V  [C0402]  (hidden comment: __Template_Cap)
C77  value 0.01UF  Voltage: 10V  [C0201Y]  (hidden comment: __Template_Cap)
C78  value 100PF  Voltage: 25V  [C0201Y]  (hidden comment: __Template_Cap)
C79  value 1UF  Voltage: 6.3V  [C0201]  (hidden comment: __Template_Cap)
C80  value 0.1UF  Voltage: 10V  [C0201Y]  (hidden comment: __Template_Cap_Auto)
C81  value 4.7UF  Voltage: 6.3V  [C0402]  (hidden comment: __Template_Cap)
C82  value 1UF  Voltage: 6.3V  [C0201]  (hidden comment: __Template_Cap)
C83  value 0.01UF  Voltage: 10V  [C0201Y]  (hidden comment: __Template_Cap)
C84  value 0.1UF  Voltage: 10V  [C0201Y]  (hidden comment: __Template_Cap_Auto)
C85  value 0.1UF  Voltage: 10V  [C0201Y]  (hidden comment: __Template_Cap_Auto)
C86  value 0.1UF  Voltage: 10V  [C0201Y]  (hidden comment: __Template_Cap_Auto)
C87  value 10UF  Voltage: 10V  [C0402]  (hidden comment: __Template_Cap)
C88  value 2.2UF  Voltage: 6.3V  [C0201]  (hidden comment: __Template_Cap)
C89  value 0.1UF  Voltage: 10V  [C0201Y]  (hidden comment: __Template_Cap_Auto)
C90  value 2.2UF  Voltage: 6.3V  [C0201]  (hidden comment: __Template_Cap)
C91  value 10UF  Voltage: 10V  [C0402]  (hidden comment: __Template_Cap)
C92  value 10UF  Voltage: 10V  [C0402]  (hidden comment: __Template_Cap)
C93  value 220PF  Voltage: 16V  [C0201Y]  (hidden comment: __Template_Cap)
FB4  value 220 OHM  [FB_ARRAY_BLA31AG221SN4D]  (hidden comment: FB_ARRAY_BLA31AG221SN4D)
L1  value 2.2uH  [IND_LPS3015-152MRB]  (hidden comment: __Template_Inductor)
U2  MFG P/N: STM32H755IIK3  [BGS201C65P15X15_1000X1000X60]  (hidden comment: MCU_STM32H755IIK3)  (part C of 3)

### Ports
3V3 (in), 3V3A (in)

### Nets
3V3: C66.1 C67.1 C68.1 C69.1 C70.1 C71.1 C72.1 C73.1 C74.1 C75.1 C76.1 C77.1 C78.1 FB4.5 U2.D5(VDD) U2.D11(VDD) U2.E2(VBAT) U2.E4(VDD) U2.E12(VDD) U2.F13(VDD33USB) U2.G4(VDD) U2.H12(VDD) U2.K4(VDD) U2.L12(VDD) U2.M5(VDD) U2.M9(VDD) ; port 3V3
3V3A: FB4.7 FB4.8 ; port 3V3A
AGND: C79.2 C80.2 C82.2 C83.2 U2.L4(VREF-) U2.N3(VSSA)
GND: C66.2 C67.2 C68.2 C69.2 C70.2 C71.2 C72.2 C73.2 C74.2 C75.2 C76.2 C77.2 C78.2 C81.2 C84.2 C85.2 C86.2 C87.2 C88.2 C89.2 C90.2 C91.1 C92.1 C93.2 U2.A1(VSS) U2.A15(VSS) U2.C2(VSS) U2.D6(VSS) U2.D10(VSS) U2.E1(VSS) U2.F2(VSSSMPS) U2.F6(VSS) U2.F7(VSS) U2.F8(VSS) U2.F9(VSS) U2.F10(VSS) U2.F12(VSS) U2.G6(VSS) U2.G7(VSS) U2.G8(VSS) U2.G9(VSS) U2.G10(VSS) U2.H6(VSS) U2.H7(VSS) U2.H8(VSS) U2.H9(VSS) U2.H10(VSS) U2.J6(VSS) U2.J7(VSS) U2.J8(VSS) U2.J9(VSS) U2.J10(VSS) U2.J14(VSS) U2.K2(VSS) U2.K6(VSS) U2.K7(VSS) U2.K8(VSS) U2.K9(VSS) U2.K10(VSS) U2.K12(VSS) U2.M6(VSS) U2.M10(VSS) U2.R1(VSS) U2.R15(VSS)
3V3A_FILT: C79.1 C80.1 FB4.3 U2.M4(VDDA)
3V3A_REF: C82.1 C83.1 FB4.4 U2.M3(VREF+)
3V3SMPS: C81.1 FB4.1 U2.G1(VDDSMPS)
LVXSMPS: C93.1 L1.1 U2.F1(VLXSMPS)
VFBSMPS: C84.1 C85.1 C86.1 C87.1 C88.1 C89.1 C90.1 C91.2 C92.2 L1.2 U2.A3(VDDLDO) U2.A4(VCAP) U2.A13(VDDLDO) U2.A14(VCAP) U2.G2(VFBSMPS) U2.R13(VCAP) U2.R14(VDDLDO)

Not connected (* = marked no-connect by the designer): FB4 2 6; U2 E15(VDD50USB)*

### Notes on the sheet
- 10x 100nF + 4.7 uF
- (near C66) 1
- (near C67) 2
- (near C68) 3
- (near C69) 4
- (near C70) 5
- (near C71) 6
- (near C72) 7
- (near C73) 8
- (near C74) 9
- (near C75) 10
- Text
- 2x 2.2uF for VCAP
- VSSA and A3v3 should have split ground plane
- datasheet page 106 for caps
- ESR < 100m OHM
- (near L1) LPS3015 2.2uH
- Direct SMPS supply (default):
  Vcap, Vddldo, VfbSMPS all tied together
  External SMPS, LDO supplied by SMPS:
  Vcap floats
  Vddldo, VfbSMPS tied together
- VDDLDO ties to 3v3 (LDO on) or Vcap (SMPS on - default)
- Vcap ties to nothing (LDO on) or VfbSMPS (SMPS on - default)
- 1x 10u cap may be removed if using smps
- datasheet page 106 for smps values incl. cap ESR
- CREATIVE COMMONS
- PUBLIC LICENSE:
- BARKOUR ROBOT
- CC BY-NC 4.0
- APPROVED
- DWG NO
- GOOGLE LLC
- FILE
- RELEASED
- 2024/05/09
- SIZE
- 1600 AMPHITHEATRE PARKWAY
- MOUNTAIN VIEW CA 94043
- A3
- SHEET
- OF
- THIS DESIGN IS BEING PROVIDED  FOR NON-COMMERCIAL USE ONLY. THE USE OF =SCIENTIST_NAME_POSSESSIVE NAME IN CONNECTION WITH THE DESIGN IS NOT INTENDED TO IMPLY THAT =SCIENTIST_NAME SPONSORS OR ENDORSES THE DESIGN, GOOGLE LLC, OR ANY OF GOOGLE LLC'S PRODUCTS OR SERVICES.
- (in symbol 934) A

### Library data of the parts
C66-C75 C80 C84-C86 C89 = 934: as C11 on sheet Processor; Status: Released; Package: 0201; Dielectric: X6S; Tolerance: 10%; Height: 0.33mm T; Supplier 1: Digi-key; HelpURL: https://www.digikey.com/product-detail/en/murata-electronics/GRT033C81A104KE01D/490-12232-1-ND/5416933; ComponentLink1Description: Datasheet; ComponentLink1URL: https://search.murata.co.jp/Ceramy/image/img/A01X/G101/ENG/GRT033C81A104KE01-01.pdf; COMMON: 150-01178-00; LOON: 150-01178-00; Supplier Part Number 1: 490-12232-1-ND
C76 C87 C91 C92 = 215: CAP, CER, X5R, 10uF, 10V, 20%, 0402, 0.7mm T; ID: 215; MFG: SAMSUNG; MFG P/N: CL05A106MP5NUNC; XPN: 150-00376-00; PROXY: Use ID #1342; EES: 150-04565-00; Status: Released; Package: 0402; Dielectric: X5R; Tolerance: 20%; Height: 0.7mm T; ComponentLink1Description: Datasheet; COMMON: 150-00376-00; LOON: 150-00376-00; Gecko: 150-00376-00
C77 C83 = 361: CAP, CER, X7R, 0.01uF, 10V, 10%, AUTO GRADE, 0201, 0.33mm T; ID: 361; MFG: MURATA; MFG P/N: GCM033R71A103KA03D; XPN: 150-01021-00; EES: 150-04564-00; Status: Released; Package: 0201; Dielectric: X7R; Tolerance: 10%; Height: 0.33mm T; ComponentLink1Description: Datasheet; COMMON: 150-01021-00; LOON: 150-01021-00; Gecko: 150-01021-00
C78 = 767: as C12 on sheet Processor; Status: Released; Package: 0201; Dielectric: X7R; Tolerance: 10%; Height: 0.33mm T; ComponentLink1Description: Datasheet; COMMON: 150-00022-00; LOON: 150-00022-00; Gecko: 150-00022-00
C79 C82 = 240: CAP, CER, X5R, 1uF, 6.3V, 20%, 0201, 0.33mm T; ID: 240; MFG: SAMSUNG; MFG P/N: CL03A105MQ3CSNC; XPN: 150-00980-00; EPIC: G150-00980-00; EES: 150-04572-00; Status: Released; Package: 0201; Dielectric: X5R; Tolerance: 20%; Height: 0.35mm; ComponentLink1Description: Datasheet; COMMON: 150-00980-00; LOON: 150-00980-00; Gecko: 150-00980-00
C81 = 50: CAP, CER, X5R, 4.7uF, 20%, 6.3V, 0402, 0.65mm; ID: 50; MFG: TDK; MFG P/N: C1005X5R0J475M050BC; XPN: 150-00023-00; PROXY: Use ID #1662; EES: 150-04574-00; Status: Released; Package: 0402; Dielectric: X5R; Tolerance: 20%; Height: 0.65mm; ComponentLink1Description: Datasheet; COMMON: 150-00023-00; LOON: 150-00023-00; Gecko: 150-00023-00
C88 C90 = 110: CAP, CER, X5R, 2.2uF, 6.3V, 20%, 0201, 0.39mm T; ID: 110; MFG: SAMSUNG; MFG P/N: CL03A225MQ3CRNC; XPN: 150-00421-00; EPIC: G150-00421-00; EES: 150-04575-00; Status: Released; Package: 0201; Dielectric: X5R; Tolerance: 20%; Height: 0.39mm T; ComponentLink1Description: Datasheet; COMMON: 150-00421-00; LOON: 150-00421-00; Gecko: 150-00421-00
C93 = 156: CAP, CER, X7R, 220pF, 16V, 10%, 0201, 0.33mm T; ID: 156; MFG: MURATA; MFG P/N: GRM033R71C221KA01D; XPN: 150-00794-00; EES: 150-04568-00; Status: Released; Package: 0201; Dielectric: X7R; Tolerance: 10%; Height: 0.33mm T; ComponentLink1Description: Datasheet; COMMON: 150-00794-00; LOON: 150-00794-00; Gecko: 150-00794-00
FB4 = 937: FERRITE, BEAD, 220 OHM, 150mA, DCR 0.25 MAX, 1206; ID: 937; Catagory: FB- 8-Pin Array; MFG: Murata Electronics; Rdc max: 250mOhm; EES: 185-00324-00; ComponentLink1Description: Datasheet; Status: Released; MFG P/N: BLA31AG221SN4D; Package: 1206-Array; Idc max: 150mA; Supplier 1: Digi-Key; HelpURL: https://www.digikey.com/product-detail/en/murata-electronics/BLA31AG221SN4D/490-9700-1-ND/4934839; ComponentLink1URL: https://www.murata.com/en-us/products/productdata/8796743204894/ENFA0008.pdf; Height: 1mm; Supplier Part Number 1: 490-9700-1-ND
L1 = 939: IND, WIREWOUND, SHIELDED, 2.2uH, 2.1A, 20%, DCR 0.11, SMD, AUTOGRADE; ID: 939; Catagory: Fixed Inductors; MFG: COILCRAFT; MFG P/N: LPS3015-222MR_; Rdc max: 110mOhms; EES: 180-02234-00; ComponentLink1Description: Datasheet; Status: Released; Package: 2 - pin SMD; Tolerance: 20%; Idc max: 2.1 A; Supplier 1: Digi-Key; HelpURL: https://www.digikey.com/products/en?keywords=LPS3015-222MR_; ComponentLink1URL: https://www.coilcraft.com/getmedia/5d262731-85ef-4348-8ab4-1044b4fc3cb8/lps3015.pdf; Height: 1.5mm; Supplier Part Number 1: 2457-LPS3015-222MR_TR-ND
U2 = 112: as U2 on sheet Processor; Status: Released; Package: 176+25UFBGA (10x10); Category: Integrated Circuits (ICs); RoHS Compliant: Yes; Supplier 1: Digi-Key; HelpURL: https://www.digikey.com/products/en?keywords=STM32H755IIK3; ComponentLink1Description: Datasheet; ComponentLink1URL: https://www.st.com/resource/en/datasheet/stm32h755ii.pdf; Height: 0.6mm; Supplier Part Number 1: 497-STM32H755IIK3-ND

## Sheet Accelerometer.SchDoc
size 420 x 297 mm; SheetNumber: 2; SheetTotal: 10; PageSetup: Record=PageOptions|CenterHorizontal=True|CenterVertical=True|PrintScale=0.96|XCorrection=1.00|YCorrection=1.00|PrintKind=1|BorderSize=5000000|LeftOffset=0|BottomOffset=0|Orientation=2|PaperLength=4318|PaperWidth=2794|Scale=100|PaperSource=7|PrintQuality=600|MediaType=1|DitherType=10|PaperKind=11" x 17"|PrintScaleMode=1
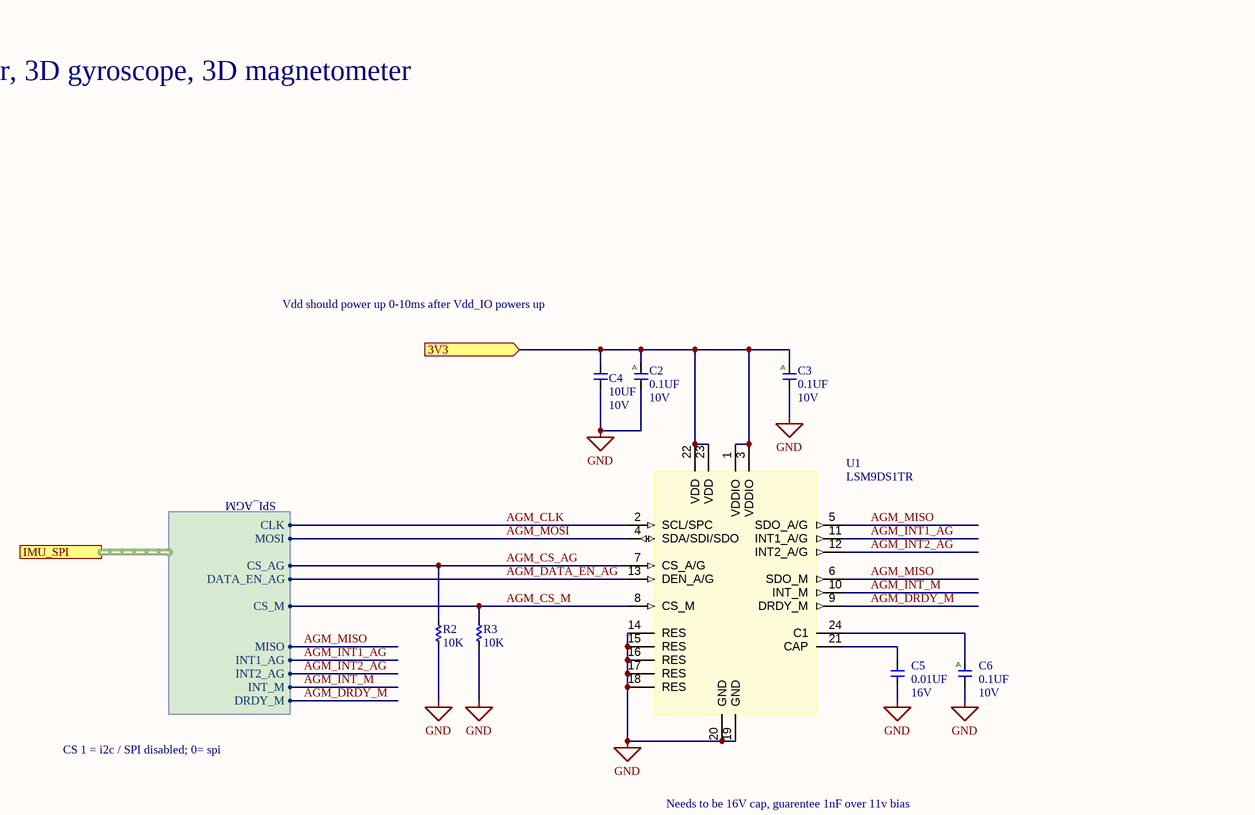
[diagram p3: Accelerometer.SchDoc]

### Parts
C2  value 0.1UF  Voltage: 10V  [C0201Y]  (hidden comment: __Template_Cap_Auto)
C3  value 0.1UF  Voltage: 10V  [C0201Y]  (hidden comment: __Template_Cap_Auto)
C4  value 10UF  Voltage: 10V  [C0402]  (hidden comment: __Template_Cap)
C5  value 0.01UF  Voltage: 16V  [C0201Y]  (hidden comment: __Template_Cap)
C6  value 0.1UF  Voltage: 10V  [C0201Y]  (hidden comment: __Template_Cap_Auto)
R2  value 10K  [R0201_H0.26MM]  (hidden comment: __Template_Resistor)
R3  value 10K  [R0201_H0.26MM]  (hidden comment: __Template_Resistor)
U1  Mfg P/N: LSM9DS1TR  [LGA24RX8X4_350X100X102]  (hidden comment: SENSOR_ST_LSM9DS1TR)

### Ports
3V3 (in), IMU_SPI (harness SPI_AGM)

### Harnesses
SPI_AGM: CLK, CS_AG, MOSI, MISO, CS_M, DATA_EN_AG, INT1_AG, INT2_AG, INT_M, DRDY_M

### Nets
3V3: C2.1 C3.1 C4.1 U1.1(VDDIO) U1.3(VDDIO) U1.22(VDD) U1.23(VDD) ; port 3V3
GND: C2.2 C3.2 C4.2 C5.2 C6.2 R2.1 R3.1 U1.14(RES) U1.15(RES) U1.16(RES) U1.17(RES) U1.18(RES) U1.19(GND) U1.20(GND)
AGM_CLK: U1.2(SCL/SPC) ; port IMU_SPI.CLK
AGM_CS_AG: R2.2 U1.7(CS_A/G) ; port IMU_SPI.CS_AG
AGM_CS_M: R3.2 U1.8(CS_M) ; port IMU_SPI.CS_M
AGM_DATA_EN_AG: U1.13(DEN_A/G) ; port IMU_SPI.DATA_EN_AG
AGM_DRDY_M: U1.9(DRDY_M) ; port IMU_SPI.DRDY_M
AGM_INT1_AG: U1.11(INT1_A/G) ; port IMU_SPI.INT1_AG
AGM_INT2_AG: U1.12(INT2_A/G) ; port IMU_SPI.INT2_AG
AGM_INT_M: U1.10(INT_M) ; port IMU_SPI.INT_M
AGM_MISO: U1.5(SDO_A/G) U1.6(SDO_M) ; port IMU_SPI.MISO
AGM_MOSI: U1.4(SDA/SDI/SDO) ; port IMU_SPI.MOSI
NetC5_1: C5.1 U1.21(CAP)
NetC6_1: C6.1 U1.24(C1)

### Notes on the sheet
- 3D accelerometer, 3D gyroscope, 3D magnetometer
- Vdd should power up 0-10ms after Vdd_IO powers up
- CS 1 = i2c / SPI disabled; 0= spi
- Needs to be 16V cap, guarentee 1nF over 11v bias
- CREATIVE COMMONS
- PUBLIC LICENSE:
- BARKOUR ROBOT
- CC BY-NC 4.0
- APPROVED
- DWG NO
- GOOGLE LLC
- FILE
- RELEASED
- 2024/05/09
- SIZE
- 1600 AMPHITHEATRE PARKWAY
- MOUNTAIN VIEW CA 94043
- A3
- SHEET
- OF
- THIS DESIGN IS BEING PROVIDED  FOR NON-COMMERCIAL USE ONLY. THE USE OF =SCIENTIST_NAME_POSSESSIVE NAME IN CONNECTION WITH THE DESIGN IS NOT INTENDED TO IMPLY THAT =SCIENTIST_NAME SPONSORS OR ENDORSES THE DESIGN, GOOGLE LLC, OR ANY OF GOOGLE LLC'S PRODUCTS OR SERVICES.
- (in symbol 934) A

### Library data of the parts
C2 C3 C6 = 934: as C11 on sheet Processor; Status: Released; Package: 0201; Dielectric: X6S; Tolerance: 10%; Height: 0.33mm T; Supplier 1: Digi-key; HelpURL: https://www.digikey.com/product-detail/en/murata-electronics/GRT033C81A104KE01D/490-12232-1-ND/5416933; ComponentLink1Description: Datasheet; ComponentLink1URL: https://search.murata.co.jp/Ceramy/image/img/A01X/G101/ENG/GRT033C81A104KE01-01.pdf; COMMON: 150-01178-00; LOON: 150-01178-00; Supplier Part Number 1: 490-12232-1-ND
C4 = 215: as C76 on sheet ProcessorSupport; Status: Released; Package: 0402; Dielectric: X5R; Tolerance: 20%; Height: 0.7mm T; ComponentLink1Description: Datasheet; COMMON: 150-00376-00; LOON: 150-00376-00; Gecko: 150-00376-00
C5 = 1238: CAP, CER, X5R, 0.01uF, 16V, 10%, 0201, 0.33mm T; ID: 1238; MFG: MURATA; MFG P/N: GRM033R61C103KA12D; XPN: 150-00126-00; EES: 150-04566-00; Status: Released; Package: 0201; Dielectric: X5R; Tolerance: 10%; Height: 0.33mm T; ComponentLink1Description: Datasheet; COMMON: 150-00126-00; LOON: 150-00126-00; Gecko: 150-00126-00
R2 R3 = 6783: as R9 on sheet Processor; Status: Released; Package: 0201; Power: 1/20W; Tolerance: 1%; Height: 0.26mm; Supplier 1: Digi-Key; HelpURL: https://www.digikey.in/product-detail/en/panasonic-electronic-components/ERJ-1GNF1002C/P122414CT-ND/7389440; ComponentLink1Description: Datasheet; ComponentLink1URL: https://industrial.panasonic.com/cdbs/www-data/pdf/RDA0000/AOA0000C304.pdf; LOON: 470-00033-00; Gecko: 470-00033-00; XPN: 470-00033-00; Supplier Part Number 1: P122414CT-ND
U1 = 172: SENSOR, MOTION, IMU, ACCELEROMETER/GYROSCOPE/MAGNETOMETER, I2C, SPI, LGA-24; ID: 172; Mfg: STMicroelectronics; OUTPUT TYPE: I²C, SPI; SENSOR TYPE: Accelerometer, Gyroscope, Magnetometer, Temperature, 9 Axis; EES: 550-00589-00; Status: Released; Package: 24-LGA; Category: Sensors; RoHS Compliant: Yes; Mounting Type: Surface Mount; Supplier 1: Digi-Key; HEIGHT (MAX): 1.027mm; OPERATING TEMPERATURE: -40°C ~ 85°C (TA); HelpURL: https://www.digikey.com/product-detail/en/stmicroelectronics/LSM9DS1TR/497-14946-1-ND/4988079; ComponentLink1Description: Datasheet; ComponentLink1URL: https://www.st.com/content/ccc/resource/technical/document/datasheet/1e/3f/2a/d6/25/eb/48/46/DM00103319.pdf/files/DM00103319.pdf/jcr:content/translations/en.DM00103319.pdf; Height: 1.027mm; Supplier Part Number 1: 497-14946-1-ND